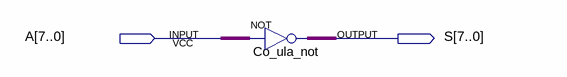
[diagram p0: schematic sheet]
// Quartus schematic not8x8.bdf as structural Verilog: 1 symbols, 2 pins
module not8x8 (
  input  [7:0] A,
  output [7:0] S
);

  assign S = ~A;  // NOT Co_ula_not, 8 bits wide
endmodule
